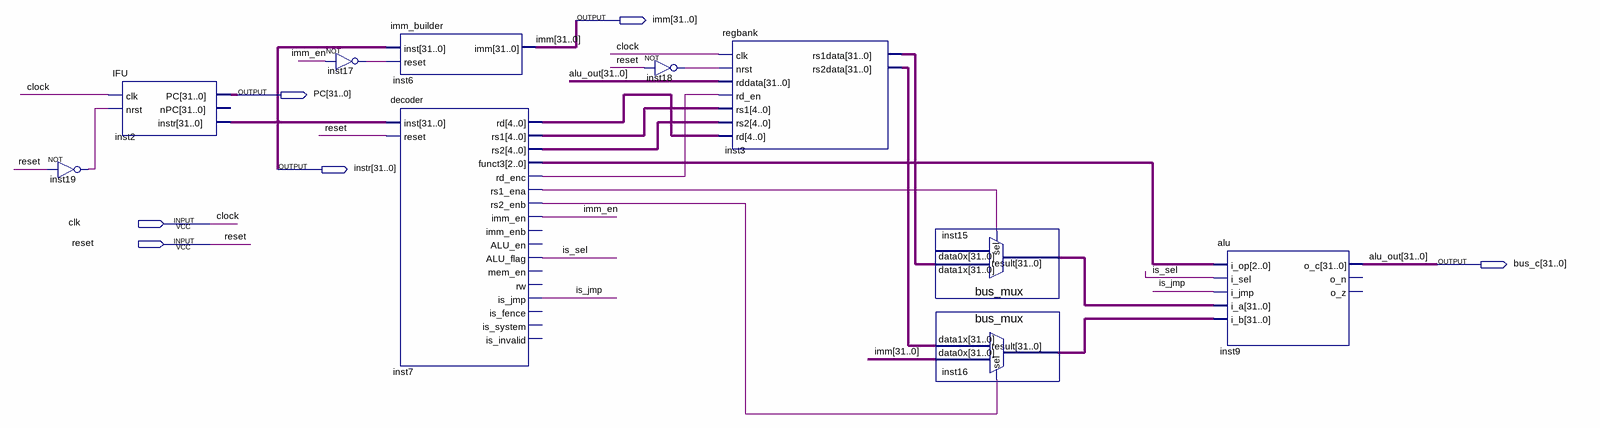
[diagram p0: schematic sheet]
// Quartus schematic ERV24-nopipe.bdf as structural Verilog: 10 symbols, 6 pins
module \ERV24-nopipe  (
  input  clk,
  input  reset,
  output [31:0] imm,
  output [31:0] PC,
  output [31:0] instr,
  output [31:0] bus_c
);

  wire imm_en, inst7_rd_enc, inst7_rs1_ena, inst7_rs2_enb, inst17_out, inst18_out, inst19_out, is_jmp, is_sel;
  wire [2:0] inst7_funct3;
  wire [4:0] inst7_rd, inst7_rs1, inst7_rs2;
  wire [31:0] inst3_rs1data, inst3_rs2data, inst15_result, inst16_result;

  not inst19 (inst19_out, reset);
  IFU inst2 (.clk(clk), .nrst(inst19_out), .PC(PC), .instr(instr));  // open: nPC
  not inst17 (inst17_out, imm_en);
  imm_builder inst6 (.inst(instr), .reset(inst17_out), .imm(imm));
  decoder inst7 (
    .inst(instr), .reset(reset), .rd(inst7_rd), .rs1(inst7_rs1), .rs2(inst7_rs2), .funct3(inst7_funct3),
    .rd_enc(inst7_rd_enc), .rs1_ena(inst7_rs1_ena), .rs2_enb(inst7_rs2_enb), .imm_en(imm_en),
    .ALU_flag(is_sel), .is_jmp(is_jmp));  // open: imm_enb, ALU_en, mem_en, rw, is_fence, is_system, is_invalid
  not inst18 (inst18_out, reset);
  regbank inst3 (
    .clk(clk), .nrst(inst18_out), .rddata(bus_c), .rd_en(inst7_rd_enc), .rs1(inst7_rs1), .rs2(inst7_rs2),
    .rd(inst7_rd), .rs1data(inst3_rs1data), .rs2data(inst3_rs2data));
  bus_mux inst15 (.data1x(inst3_rs1data), .sel(inst7_rs1_ena), .result(inst15_result));  // open: data0x
  bus_mux inst16 (.data1x(inst3_rs2data), .data0x(imm), .sel(inst7_rs2_enb), .result(inst16_result));
  alu inst9 (
    .i_op(inst7_funct3), .i_sel(is_sel), .i_jmp(is_jmp), .i_a(inst15_result), .i_b(inst16_result), .o_c(bus_c));  // open: o_n, o_z

  // Other names for the same wires on the sheet: alu_out[31:0] = bus_c; clock = clk
endmodule
